# EAGLE schematic musical-plant (EAGLE 7.6.0)
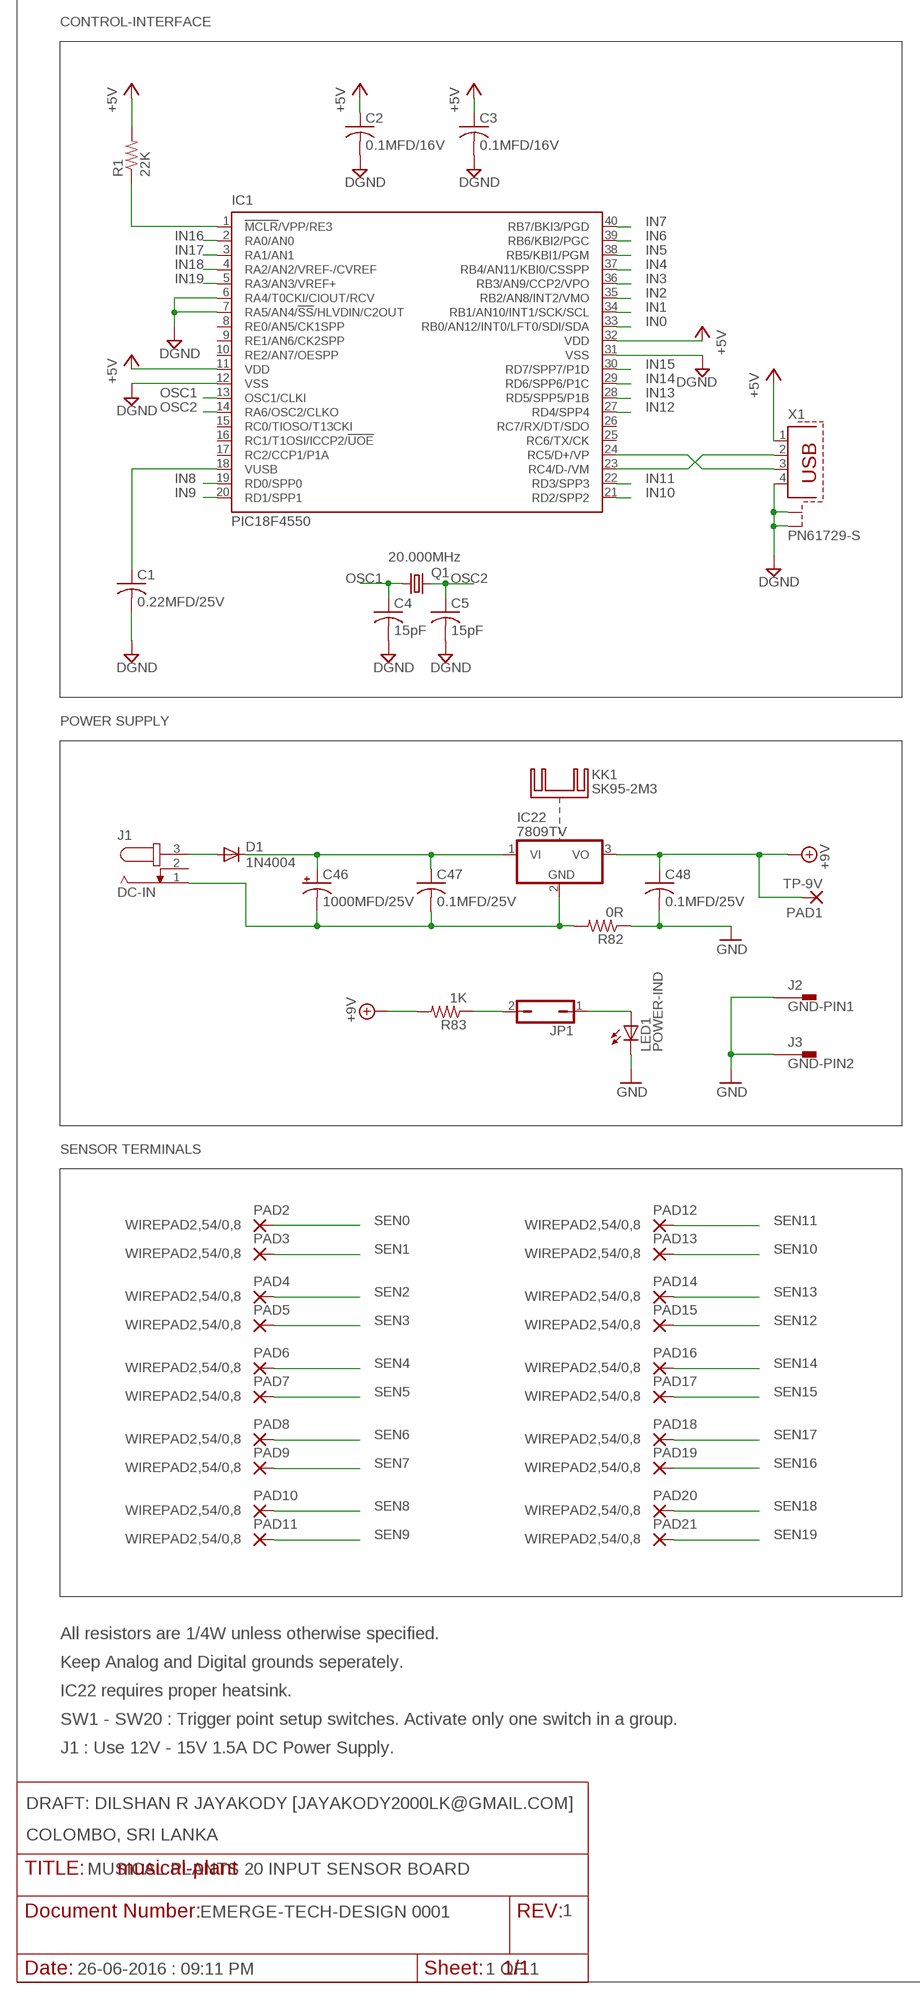
[diagram p0: schematic, sheet 1, part 1 of 2]
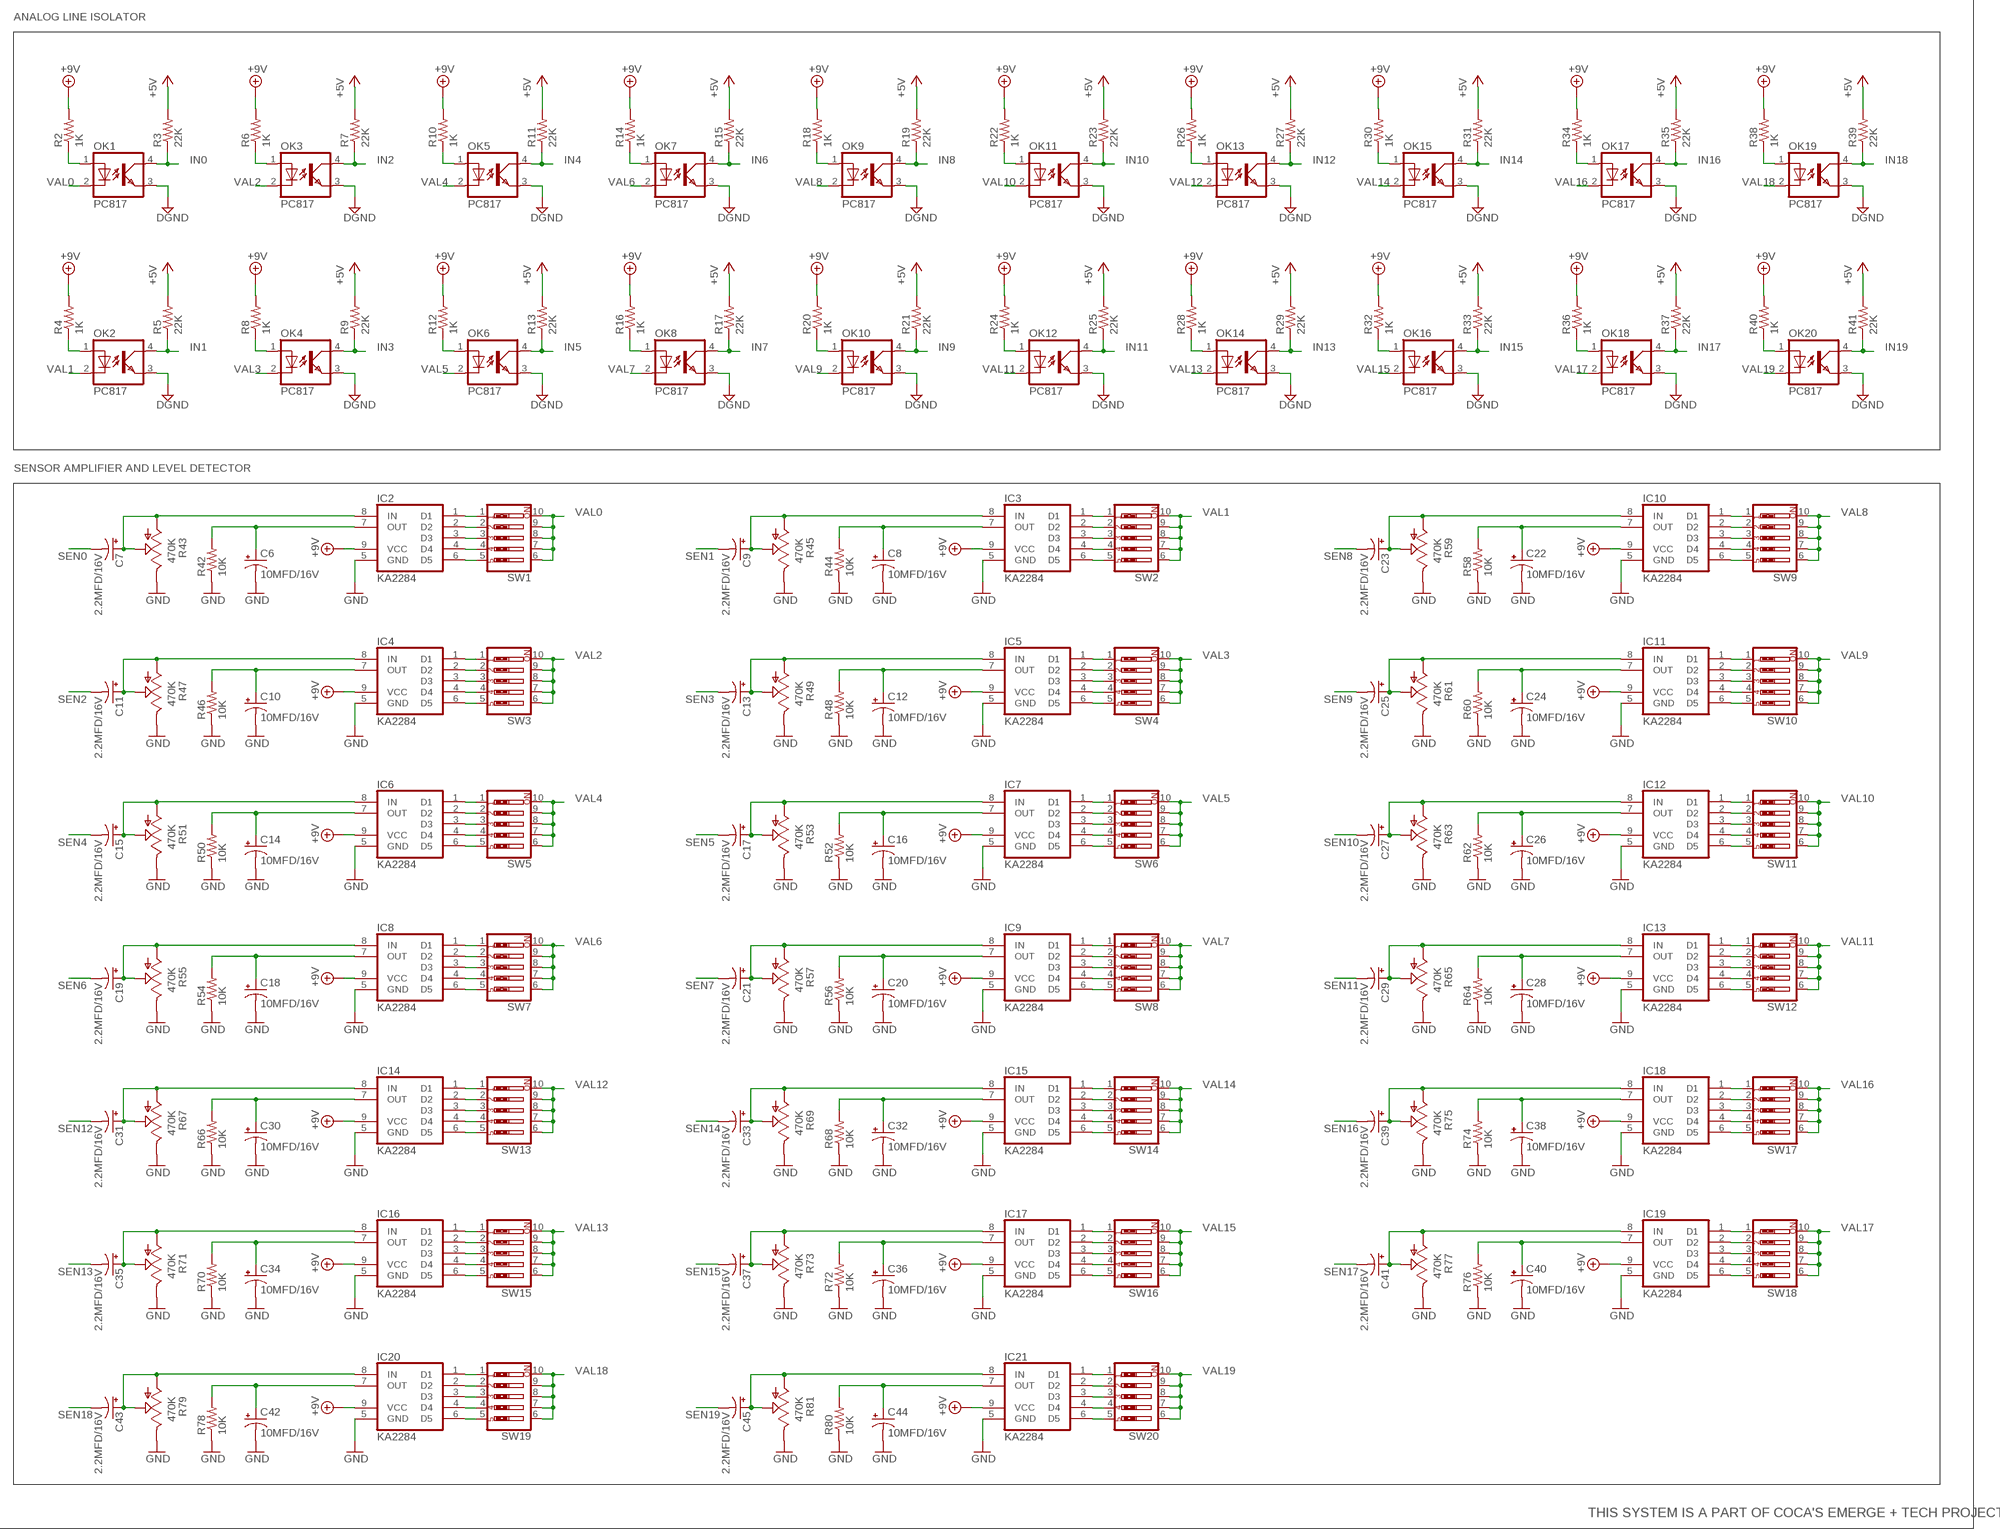
[diagram p1: schematic, sheet 1, part 2 of 2]

## Parts
C1  0.22MFD/25V  C-US075-052X106  [C075-052X106]
C2  0.1MFD/16V  C-US050-030X075  [C050-030X075]
C3  0.1MFD/16V  C-US050-030X075  [C050-030X075]
C4  15pF  C-US025-025X050  [C025-025X050]
C5  15pF  C-US025-025X050  [C025-025X050]
C6  10MFD/16V  CPOL-USE2,5-6E  [E2,5-6E]
C7  2.2MFD/16V  CPOL-USE2,5-6E  [E2,5-6E]
C8  10MFD/16V  CPOL-USE2,5-6E  [E2,5-6E]
C9  2.2MFD/16V  CPOL-USE2,5-6E  [E2,5-6E]
C10  10MFD/16V  CPOL-USE2,5-6E  [E2,5-6E]
C11  2.2MFD/16V  CPOL-USE2,5-6E  [E2,5-6E]
C12  10MFD/16V  CPOL-USE2,5-6E  [E2,5-6E]
C13  2.2MFD/16V  CPOL-USE2,5-6E  [E2,5-6E]
C14  10MFD/16V  CPOL-USE2,5-6E  [E2,5-6E]
C15  2.2MFD/16V  CPOL-USE2,5-6E  [E2,5-6E]
C16  10MFD/16V  CPOL-USE2,5-6E  [E2,5-6E]
C17  2.2MFD/16V  CPOL-USE2,5-6E  [E2,5-6E]
C18  10MFD/16V  CPOL-USE2,5-6E  [E2,5-6E]
C19  2.2MFD/16V  CPOL-USE2,5-6E  [E2,5-6E]
C20  10MFD/16V  CPOL-USE2,5-6E  [E2,5-6E]
C21  2.2MFD/16V  CPOL-USE2,5-6E  [E2,5-6E]
C22  10MFD/16V  CPOL-USE2,5-6E  [E2,5-6E]
C23  2.2MFD/16V  CPOL-USE2,5-6E  [E2,5-6E]
C24  10MFD/16V  CPOL-USE2,5-6E  [E2,5-6E]
C25  2.2MFD/16V  CPOL-USE2,5-6E  [E2,5-6E]
C26  10MFD/16V  CPOL-USE2,5-6E  [E2,5-6E]
C27  2.2MFD/16V  CPOL-USE2,5-6E  [E2,5-6E]
C28  10MFD/16V  CPOL-USE2,5-6E  [E2,5-6E]
C29  2.2MFD/16V  CPOL-USE2,5-6E  [E2,5-6E]
C30  10MFD/16V  CPOL-USE2,5-6E  [E2,5-6E]
C31  2.2MFD/16V  CPOL-USE2,5-6E  [E2,5-6E]
C32  10MFD/16V  CPOL-USE2,5-6E  [E2,5-6E]
C33  2.2MFD/16V  CPOL-USE2,5-6E  [E2,5-6E]
C34  10MFD/16V  CPOL-USE2,5-6E  [E2,5-6E]
C35  2.2MFD/16V  CPOL-USE2,5-6E  [E2,5-6E]
C36  10MFD/16V  CPOL-USE2,5-6E  [E2,5-6E]
C37  2.2MFD/16V  CPOL-USE2,5-6E  [E2,5-6E]
C38  10MFD/16V  CPOL-USE2,5-6E  [E2,5-6E]
C39  2.2MFD/16V  CPOL-USE2,5-6E  [E2,5-6E]
C40  10MFD/16V  CPOL-USE2,5-6E  [E2,5-6E]
C41  2.2MFD/16V  CPOL-USE2,5-6E  [E2,5-6E]
C42  10MFD/16V  CPOL-USE2,5-6E  [E2,5-6E]
C43  2.2MFD/16V  CPOL-USE2,5-6E  [E2,5-6E]
C44  10MFD/16V  CPOL-USE2,5-6E  [E2,5-6E]
C45  2.2MFD/16V  CPOL-USE2,5-6E  [E2,5-6E]
C46  1000MFD/25V  CPOL-USE5-13  [E5-13]
C47  0.1MFD/25V  C-US075-052X106  [C075-052X106]
C48  0.1MFD/25V  C-US075-052X106  [C075-052X106]
D1  1N4004  [DO41-10]
IC1  PIC18F4550  PIC18F4550_40  [DIL40]
IC2  KA2284  [SIP-9]
IC3  KA2284  [SIP-9]
IC4  KA2284  [SIP-9]
IC5  KA2284  [SIP-9]
IC6  KA2284  [SIP-9]
IC7  KA2284  [SIP-9]
IC8  KA2284  [SIP-9]
IC9  KA2284  [SIP-9]
IC10  KA2284  [SIP-9]
IC11  KA2284  [SIP-9]
IC12  KA2284  [SIP-9]
IC13  KA2284  [SIP-9]
IC14  KA2284  [SIP-9]
IC15  KA2284  [SIP-9]
IC16  KA2284  [SIP-9]
IC17  KA2284  [SIP-9]
IC18  KA2284  [SIP-9]
IC19  KA2284  [SIP-9]
IC20  KA2284  [SIP-9]
IC21  KA2284  [SIP-9]
IC22  7809TV  7812TV  [TO220V]
J1  DC-IN  JACK-PLUG1  [SPC4078]
J2  GND-PIN1  PIN2F061.080  [F061.080]
J3  GND-PIN2  PIN2F061.080  [F061.080]
JP1  JP1Q  [JP1]
KK1  SK95-2M3  [SK95-2M3]
LED1  POWER-IND  LED3MM  [LED3MM]
OK1  PC817  [DIL04]
OK2  PC817  [DIL04]
OK3  PC817  [DIL04]
OK4  PC817  [DIL04]
OK5  PC817  [DIL04]
OK6  PC817  [DIL04]
OK7  PC817  [DIL04]
OK8  PC817  [DIL04]
OK9  PC817  [DIL04]
OK10  PC817  [DIL04]
OK11  PC817  [DIL04]
OK12  PC817  [DIL04]
OK13  PC817  [DIL04]
OK14  PC817  [DIL04]
OK15  PC817  [DIL04]
OK16  PC817  [DIL04]
OK17  PC817  [DIL04]
OK18  PC817  [DIL04]
OK19  PC817  [DIL04]
OK20  PC817  [DIL04]
PAD1  TP-9V  WIREPAD2,15/1,0  [2,15/1,0]
PAD2  WIREPAD2,54/0,8  [2,54/0,8]
PAD3  WIREPAD2,54/0,8  [2,54/0,8]
PAD4  WIREPAD2,54/0,8  [2,54/0,8]
PAD5  WIREPAD2,54/0,8  [2,54/0,8]
PAD6  WIREPAD2,54/0,8  [2,54/0,8]
PAD7  WIREPAD2,54/0,8  [2,54/0,8]
PAD8  WIREPAD2,54/0,8  [2,54/0,8]
PAD9  WIREPAD2,54/0,8  [2,54/0,8]
PAD10  WIREPAD2,54/0,8  [2,54/0,8]
PAD11  WIREPAD2,54/0,8  [2,54/0,8]
PAD12  WIREPAD2,54/0,8  [2,54/0,8]
PAD13  WIREPAD2,54/0,8  [2,54/0,8]
PAD14  WIREPAD2,54/0,8  [2,54/0,8]
PAD15  WIREPAD2,54/0,8  [2,54/0,8]
PAD16  WIREPAD2,54/0,8  [2,54/0,8]
PAD17  WIREPAD2,54/0,8  [2,54/0,8]
PAD18  WIREPAD2,54/0,8  [2,54/0,8]
PAD19  WIREPAD2,54/0,8  [2,54/0,8]
PAD20  WIREPAD2,54/0,8  [2,54/0,8]
PAD21  WIREPAD2,54/0,8  [2,54/0,8]
Q1  20.000MHz  CRYSTALHC49S  [HC49/S]
R1  22K  R-US_0207/10  [0207/10]
R2  1K  R-US_0207/10  [0207/10]
R3  22K  R-US_0207/15  [0207/15]
R4  1K  R-US_0207/10  [0207/10]
R5  22K  R-US_0207/15  [0207/15]
R6  1K  R-US_0207/10  [0207/10]
R7  22K  R-US_0207/15  [0207/15]
R8  1K  R-US_0207/10  [0207/10]
R9  22K  R-US_0207/15  [0207/15]
R10  1K  R-US_0207/10  [0207/10]
R11  22K  R-US_0207/15  [0207/15]
R12  1K  R-US_0207/10  [0207/10]
R13  22K  R-US_0207/15  [0207/15]
R14  1K  R-US_0207/10  [0207/10]
R15  22K  R-US_0207/15  [0207/15]
R16  1K  R-US_0207/10  [0207/10]
R17  22K  R-US_0207/15  [0207/15]
R18  1K  R-US_0207/10  [0207/10]
R19  22K  R-US_0207/15  [0207/15]
R20  1K  R-US_0207/10  [0207/10]
R21  22K  R-US_0207/15  [0207/15]
R22  1K  R-US_0207/10  [0207/10]
R23  22K  R-US_0207/15  [0207/15]
R24  1K  R-US_0207/10  [0207/10]
R25  22K  R-US_0207/15  [0207/15]
R26  1K  R-US_0207/10  [0207/10]
R27  22K  R-US_0207/15  [0207/15]
R28  1K  R-US_0207/10  [0207/10]
R29  22K  R-US_0207/15  [0207/15]
R30  1K  R-US_0207/10  [0207/10]
R31  22K  R-US_0207/15  [0207/15]
R32  1K  R-US_0207/10  [0207/10]
R33  22K  R-US_0207/15  [0207/15]
R34  1K  R-US_0207/10  [0207/10]
R35  22K  R-US_0207/15  [0207/15]
R36  1K  R-US_0207/10  [0207/10]
R37  22K  R-US_0207/15  [0207/15]
R38  1K  R-US_0207/10  [0207/10]
R39  22K  R-US_0207/15  [0207/15]
R40  1K  R-US_0207/10  [0207/10]
R41  22K  R-US_0207/15  [0207/15]
R42  10K  R-US_0207/10  [0207/10]
R43  470K  TRIM_US-RS3  [RS3]
R44  10K  R-US_0207/10  [0207/10]
R45  470K  TRIM_US-RS3  [RS3]
R46  10K  R-US_0207/10  [0207/10]
R47  470K  TRIM_US-RS3  [RS3]
R48  10K  R-US_0207/10  [0207/10]
R49  470K  TRIM_US-RS3  [RS3]
R50  10K  R-US_0207/10  [0207/10]
R51  470K  TRIM_US-RS3  [RS3]
R52  10K  R-US_0207/10  [0207/10]
R53  470K  TRIM_US-RS3  [RS3]
R54  10K  R-US_0207/10  [0207/10]
R55  470K  TRIM_US-RS3  [RS3]
R56  10K  R-US_0207/10  [0207/10]
R57  470K  TRIM_US-RS3  [RS3]
R58  10K  R-US_0207/10  [0207/10]
R59  470K  TRIM_US-RS3  [RS3]
R60  10K  R-US_0207/10  [0207/10]
R61  470K  TRIM_US-RS3  [RS3]
R62  10K  R-US_0207/10  [0207/10]
R63  470K  TRIM_US-RS3  [RS3]
R64  10K  R-US_0207/10  [0207/10]
R65  470K  TRIM_US-RS3  [RS3]
R66  10K  R-US_0207/10  [0207/10]
R67  470K  TRIM_US-RS3  [RS3]
R68  10K  R-US_0207/10  [0207/10]
R69  470K  TRIM_US-RS3  [RS3]
R70  10K  R-US_0207/10  [0207/10]
R71  470K  TRIM_US-RS3  [RS3]
R72  10K  R-US_0207/10  [0207/10]
R73  470K  TRIM_US-RS3  [RS3]
R74  10K  R-US_0207/10  [0207/10]
R75  470K  TRIM_US-RS3  [RS3]
R76  10K  R-US_0207/10  [0207/10]
R77  470K  TRIM_US-RS3  [RS3]
R78  10K  R-US_0207/10  [0207/10]
R79  470K  TRIM_US-RS3  [RS3]
R80  10K  R-US_0207/10  [0207/10]
R81  470K  TRIM_US-RS3  [RS3]
R82  0R  R-US_0207/10  [0207/10]
R83  1K  R-US_0207/10  [0207/10]
SW1  SW_DIP-5  [EDG-05]
SW2  SW_DIP-5  [EDG-05]
SW3  SW_DIP-5  [EDG-05]
SW4  SW_DIP-5  [EDG-05]
SW5  SW_DIP-5  [EDG-05]
SW6  SW_DIP-5  [EDG-05]
SW7  SW_DIP-5  [EDG-05]
SW8  SW_DIP-5  [EDG-05]
SW9  SW_DIP-5  [EDG-05]
SW10  SW_DIP-5  [EDG-05]
SW11  SW_DIP-5  [EDG-05]
SW12  SW_DIP-5  [EDG-05]
SW13  SW_DIP-5  [EDG-05]
SW14  SW_DIP-5  [EDG-05]
SW15  SW_DIP-5  [EDG-05]
SW16  SW_DIP-5  [EDG-05]
SW17  SW_DIP-5  [EDG-05]
SW18  SW_DIP-5  [EDG-05]
SW19  SW_DIP-5  [EDG-05]
SW20  SW_DIP-5  [EDG-05]
X1  PN61729-S  [PN61729-S]

## Nets
+5V: C2.1 C3.1 IC1.11(VDD) IC1.32(VDD) R1.2 R3.2 R5.2 R7.2 R9.2 R11.2 R13.2 R15.2 R17.2 R19.2 R21.2 R23.2 R25.2 R27.2 R29.2 R31.2 R33.2 R35.2 R37.2 R39.2 R41.2 X1.1
+9V: C48.1 IC2.9(VCC) IC3.9(VCC) IC4.9(VCC) IC5.9(VCC) IC6.9(VCC) IC7.9(VCC) IC8.9(VCC) IC9.9(VCC) IC10.9(VCC) IC11.9(VCC) IC12.9(VCC) IC13.9(VCC) IC14.9(VCC) IC15.9(VCC) IC16.9(VCC) IC17.9(VCC) IC18.9(VCC) IC19.9(VCC) IC20.9(VCC) IC21.9(VCC) IC22.3(VO) PAD1.1(P) R2.2 R4.2 R6.2 R8.2 R10.2 R12.2 R14.2 R16.2 R18.2 R20.2 R22.2 R24.2 R26.2 R28.2 R30.2 R32.2 R34.2 R36.2 R38.2 R40.2 R83.2
D-MINUS: IC1.23(RC4/D-/VM) X1.2
D-PLUS: IC1.24(RC5/D+/VP) X1.3
DGND: C1.2 C2.2 C3.2 C4.2 C5.2 IC1.6(RA4/T0CKI/CIOUT/RCV) IC1.7(RA5/AN4/!SS!/HLVDIN/C2OUT) IC1.12(VSS) IC1.31(VSS) OK1.3(EMIT) OK2.3(EMIT) OK3.3(EMIT) OK4.3(EMIT) OK5.3(EMIT) OK6.3(EMIT) OK7.3(EMIT) OK8.3(EMIT) OK9.3(EMIT) OK10.3(EMIT) OK11.3(EMIT) OK12.3(EMIT) OK13.3(EMIT) OK14.3(EMIT) OK15.3(EMIT) OK16.3(EMIT) OK17.3(EMIT) OK18.3(EMIT) OK19.3(EMIT) OK20.3(EMIT) X1.4 X1.S1 X1.S2
GND: C6.- C8.- C10.- C12.- C14.- C16.- C18.- C20.- C22.- C24.- C26.- C28.- C30.- C32.- C34.- C36.- C38.- C40.- C42.- C44.- C48.2 IC2.5(GND) IC3.5(GND) IC4.5(GND) IC5.5(GND) IC6.5(GND) IC7.5(GND) IC8.5(GND) IC9.5(GND) IC10.5(GND) IC11.5(GND) IC12.5(GND) IC13.5(GND) IC14.5(GND) IC15.5(GND) IC16.5(GND) IC17.5(GND) IC18.5(GND) IC19.5(GND) IC20.5(GND) IC21.5(GND) J2.1A J2.1B J3.1A J3.1B LED1.K(C) R42.1 R43.E R44.1 R45.E R46.1 R47.E R48.1 R49.E R50.1 R51.E R52.1 R53.E R54.1 R55.E R56.1 R57.E R58.1 R59.E R60.1 R61.E R62.1 R63.E R64.1 R65.E R66.1 R67.E R68.1 R69.E R70.1 R71.E R72.1 R73.E R74.1 R75.E R76.1 R77.E R78.1 R79.E R80.1 R81.E R82.1
IN0: IC1.33(RB0/AN12/INT0/LFT0/SDI/SDA) OK1.4(COL) R3.1
IN1: IC1.34(RB1/AN10/INT1/SCK/SCL) OK2.4(COL) R5.1
IN2: IC1.35(RB2/AN8/INT2/VMO) OK3.4(COL) R7.1
IN3: IC1.36(RB3/AN9/CCP2/VPO) OK4.4(COL) R9.1
IN4: IC1.37(RB4/AN11/KBI0/CSSPP) OK5.4(COL) R11.1
IN5: IC1.38(RB5/KBI1/PGM) OK6.4(COL) R13.1
IN6: IC1.39(RB6/KBI2/PGC) OK7.4(COL) R15.1
IN7: IC1.40(RB7/BKI3/PGD) OK8.4(COL) R17.1
IN8: IC1.19(RD0/SPP0) OK9.4(COL) R19.1
IN9: IC1.20(RD1/SPP1) OK10.4(COL) R21.1
IN10: IC1.21(RD2/SPP2) OK11.4(COL) R23.1
IN11: IC1.22(RD3/SPP3) OK12.4(COL) R25.1
IN12: IC1.27(RD4/SPP4) OK13.4(COL) R27.1
IN13: IC1.28(RD5/SPP5/P1B) OK14.4(COL) R29.1
IN14: IC1.29(RD6/SPP6/P1C) OK15.4(COL) R31.1
IN15: IC1.30(RD7/SPP7/P1D) OK16.4(COL) R33.1
IN16: IC1.2(RA0/AN0) OK17.4(COL) R35.1
IN17: IC1.3(RA1/AN1) OK18.4(COL) R37.1
IN18: IC1.4(RA2/AN2/VREF-/CVREF) OK19.4(COL) R39.1
IN19: IC1.5(RA3/AN3/VREF+) OK20.4(COL) R41.1
MCLR: IC1.1(!MCLR!/VPP/RE3) R1.1
N$1: OK1.1(A) R2.1
N$2: OK2.1(A) R4.1
N$3: OK3.1(A) R6.1
N$4: OK4.1(A) R8.1
N$5: OK5.1(A) R10.1
N$6: OK6.1(A) R12.1
N$7: OK7.1(A) R14.1
N$8: OK8.1(A) R16.1
N$9: OK9.1(A) R18.1
N$10: OK10.1(A) R20.1
N$11: OK11.1(A) R22.1
N$12: OK12.1(A) R24.1
N$13: OK13.1(A) R26.1
N$14: OK14.1(A) R28.1
N$15: OK15.1(A) R30.1
N$16: OK16.1(A) R32.1
N$17: OK17.1(A) R34.1
N$18: OK18.1(A) R36.1
N$19: OK19.1(A) R38.1
N$20: OK20.1(A) R40.1
N$21: IC2.1(D1) SW1.1
N$22: IC2.2(D2) SW1.2
N$23: IC2.3(D3) SW1.3
N$24: IC2.4(D4) SW1.4
N$25: IC2.6(D5) SW1.5
N$26: C6.+ IC2.7(OUT) R42.2
N$27: C7.+ IC2.8(IN) R43.A R43.S
N$28: IC3.1(D1) SW2.1
N$29: IC3.2(D2) SW2.2
N$30: IC3.3(D3) SW2.3
N$31: IC3.4(D4) SW2.4
N$32: IC3.6(D5) SW2.5
N$33: C8.+ IC3.7(OUT) R44.2
N$34: C9.+ IC3.8(IN) R45.A R45.S
N$35: IC4.1(D1) SW3.1
N$36: IC4.2(D2) SW3.2
N$37: IC4.3(D3) SW3.3
N$38: IC4.4(D4) SW3.4
N$39: IC4.6(D5) SW3.5
N$40: C10.+ IC4.7(OUT) R46.2
N$41: C11.+ IC4.8(IN) R47.A R47.S
N$42: IC5.1(D1) SW4.1
N$43: IC5.2(D2) SW4.2
N$44: IC5.3(D3) SW4.3
N$45: IC5.4(D4) SW4.4
N$46: IC5.6(D5) SW4.5
N$47: C12.+ IC5.7(OUT) R48.2
N$48: C13.+ IC5.8(IN) R49.A R49.S
N$49: IC6.1(D1) SW5.1
N$50: IC6.2(D2) SW5.2
N$51: IC6.3(D3) SW5.3
N$52: IC6.4(D4) SW5.4
N$53: IC6.6(D5) SW5.5
N$54: C14.+ IC6.7(OUT) R50.2
N$55: C15.+ IC6.8(IN) R51.A R51.S
N$56: IC7.1(D1) SW6.1
N$57: IC7.2(D2) SW6.2
N$58: IC7.3(D3) SW6.3
N$59: IC7.4(D4) SW6.4
N$60: IC7.6(D5) SW6.5
N$61: C16.+ IC7.7(OUT) R52.2
N$62: C17.+ IC7.8(IN) R53.A R53.S
N$63: IC8.1(D1) SW7.1
N$64: IC8.2(D2) SW7.2
N$65: IC8.3(D3) SW7.3
N$66: IC8.4(D4) SW7.4
N$67: IC8.6(D5) SW7.5
N$68: C18.+ IC8.7(OUT) R54.2
N$69: C19.+ IC8.8(IN) R55.A R55.S
N$70: IC9.1(D1) SW8.1
N$71: IC9.2(D2) SW8.2
N$72: IC9.3(D3) SW8.3
N$73: IC9.4(D4) SW8.4
N$74: IC9.6(D5) SW8.5
N$75: C20.+ IC9.7(OUT) R56.2
N$76: C21.+ IC9.8(IN) R57.A R57.S
N$77: IC10.1(D1) SW9.1
N$78: IC10.2(D2) SW9.2
N$79: IC10.3(D3) SW9.3
N$80: IC10.4(D4) SW9.4
N$81: IC10.6(D5) SW9.5
N$82: C22.+ IC10.7(OUT) R58.2
N$83: C23.+ IC10.8(IN) R59.A R59.S
N$84: IC11.1(D1) SW10.1
N$85: IC11.2(D2) SW10.2
N$86: IC11.3(D3) SW10.3
N$87: IC11.4(D4) SW10.4
N$88: IC11.6(D5) SW10.5
N$89: C24.+ IC11.7(OUT) R60.2
N$90: C25.+ IC11.8(IN) R61.A R61.S
N$91: IC12.1(D1) SW11.1
N$92: IC12.2(D2) SW11.2
N$93: IC12.3(D3) SW11.3
N$94: IC12.4(D4) SW11.4
N$95: IC12.6(D5) SW11.5
N$96: C26.+ IC12.7(OUT) R62.2
N$97: C27.+ IC12.8(IN) R63.A R63.S
N$98: IC13.1(D1) SW12.1
N$99: IC13.2(D2) SW12.2
N$100: IC13.3(D3) SW12.3
N$101: IC13.4(D4) SW12.4
N$102: IC13.6(D5) SW12.5
N$103: C28.+ IC13.7(OUT) R64.2
N$104: C29.+ IC13.8(IN) R65.A R65.S
N$105: IC14.1(D1) SW13.1
N$106: IC14.2(D2) SW13.2
N$107: IC14.3(D3) SW13.3
N$108: IC14.4(D4) SW13.4
N$109: IC14.6(D5) SW13.5
N$110: C30.+ IC14.7(OUT) R66.2
N$111: C31.+ IC14.8(IN) R67.A R67.S
N$112: IC15.1(D1) SW14.1
N$113: IC15.2(D2) SW14.2
N$114: IC15.3(D3) SW14.3
N$115: IC15.4(D4) SW14.4
N$116: IC15.6(D5) SW14.5
N$117: C32.+ IC15.7(OUT) R68.2
N$118: C33.+ IC15.8(IN) R69.A R69.S
N$119: IC16.1(D1) SW15.1
N$120: IC16.2(D2) SW15.2
N$121: IC16.3(D3) SW15.3
N$122: IC16.4(D4) SW15.4
N$123: IC16.6(D5) SW15.5
N$124: C34.+ IC16.7(OUT) R70.2
N$125: C35.+ IC16.8(IN) R71.A R71.S
N$126: IC17.1(D1) SW16.1
N$127: IC17.2(D2) SW16.2
N$128: IC17.3(D3) SW16.3
N$129: IC17.4(D4) SW16.4
N$130: IC17.6(D5) SW16.5
N$131: C36.+ IC17.7(OUT) R72.2
N$132: C37.+ IC17.8(IN) R73.A R73.S
N$133: IC18.1(D1) SW17.1
N$134: IC18.2(D2) SW17.2
N$135: IC18.3(D3) SW17.3
N$136: IC18.4(D4) SW17.4
N$137: IC18.6(D5) SW17.5
N$138: C38.+ IC18.7(OUT) R74.2
N$139: C39.+ IC18.8(IN) R75.A R75.S
N$140: IC19.1(D1) SW18.1
N$141: IC19.2(D2) SW18.2
N$142: IC19.3(D3) SW18.3
N$143: IC19.4(D4) SW18.4
N$144: IC19.6(D5) SW18.5
N$145: C40.+ IC19.7(OUT) R76.2
N$146: C41.+ IC19.8(IN) R77.A R77.S
N$147: IC20.1(D1) SW19.1
N$148: IC20.2(D2) SW19.2
N$149: IC20.3(D3) SW19.3
N$150: IC20.4(D4) SW19.4
N$151: IC20.6(D5) SW19.5
N$152: C42.+ IC20.7(OUT) R78.2
N$153: C43.+ IC20.8(IN) R79.A R79.S
N$154: IC21.1(D1) SW20.1
N$155: IC21.2(D2) SW20.2
N$156: IC21.3(D3) SW20.3
N$157: IC21.4(D4) SW20.4
N$158: IC21.6(D5) SW20.5
N$159: C44.+ IC21.7(OUT) R80.2
N$160: C45.+ IC21.8(IN) R81.A R81.S
N$161: D1.A J1.3
N$162: C46.+ C47.1 D1.C IC22.1(VI)
N$163: C46.- C47.2 IC22.2(GND) J1.1 R82.2
N$164: JP1.1 LED1.A
N$165: JP1.2 R83.1
OSC1: C4.1 IC1.13(OSC1/CLKI) Q1.1
OSC2: C5.1 IC1.14(RA6/OSC2/CLKO) Q1.2
SEN0: C7.- PAD2.1(P)
SEN1: C9.- PAD3.1(P)
SEN2: C11.- PAD4.1(P)
SEN3: C13.- PAD5.1(P)
SEN4: C15.- PAD6.1(P)
SEN5: C17.- PAD7.1(P)
SEN6: C19.- PAD8.1(P)
SEN7: C21.- PAD9.1(P)
SEN8: C23.- PAD10.1(P)
SEN9: C25.- PAD11.1(P)
SEN10: C27.- PAD13.1(P)
SEN11: C29.- PAD12.1(P)
SEN12: C31.- PAD15.1(P)
SEN13: C35.- PAD14.1(P)
SEN14: C33.- PAD16.1(P)
SEN15: C37.- PAD17.1(P)
SEN16: C39.- PAD19.1(P)
SEN17: C41.- PAD18.1(P)
SEN18: C43.- PAD20.1(P)
SEN19: C45.- PAD21.1(P)
VAL0: OK1.2(C) SW1.6 SW1.7 SW1.8 SW1.9 SW1.10
VAL1: OK2.2(C) SW2.6 SW2.7 SW2.8 SW2.9 SW2.10
VAL2: OK3.2(C) SW3.6 SW3.7 SW3.8 SW3.9 SW3.10
VAL3: OK4.2(C) SW4.6 SW4.7 SW4.8 SW4.9 SW4.10
VAL4: OK5.2(C) SW5.6 SW5.7 SW5.8 SW5.9 SW5.10
VAL5: OK6.2(C) SW6.6 SW6.7 SW6.8 SW6.9 SW6.10
VAL6: OK7.2(C) SW7.6 SW7.7 SW7.8 SW7.9 SW7.10
VAL7: OK8.2(C) SW8.6 SW8.7 SW8.8 SW8.9 SW8.10
VAL8: OK9.2(C) SW9.6 SW9.7 SW9.8 SW9.9 SW9.10
VAL9: OK10.2(C) SW10.6 SW10.7 SW10.8 SW10.9 SW10.10
VAL10: OK11.2(C) SW11.6 SW11.7 SW11.8 SW11.9 SW11.10
VAL11: OK12.2(C) SW12.6 SW12.7 SW12.8 SW12.9 SW12.10
VAL12: OK13.2(C) SW13.6 SW13.7 SW13.8 SW13.9 SW13.10
VAL13: OK14.2(C) SW15.6 SW15.7 SW15.8 SW15.9 SW15.10
VAL14: OK15.2(C) SW14.6 SW14.7 SW14.8 SW14.9 SW14.10
VAL15: OK16.2(C) SW16.6 SW16.7 SW16.8 SW16.9 SW16.10
VAL16: OK17.2(C) SW17.6 SW17.7 SW17.8 SW17.9 SW17.10
VAL17: OK18.2(C) SW18.6 SW18.7 SW18.8 SW18.9 SW18.10
VAL18: OK19.2(C) SW19.6 SW19.7 SW19.8 SW19.9 SW19.10
VAL19: OK20.2(C) SW20.6 SW20.7 SW20.8 SW20.9 SW20.10
VUSB: C1.1 IC1.18(VUSB)
Unconnected: IC1.8(RE0/AN5/CK1SPP) IC1.9(RE1/AN6/CK2SPP) IC1.10(RE2/AN7/OESPP) IC1.15(RC0/TIOSO/T13CKI) IC1.16(RC1/T1OSI/ICCP2/!UOE) IC1.17(RC2/CCP1/P1A) IC1.25(RC6/TX/CK) IC1.26(RC7/RX/DT/SDO) J1.2

## Notes on the sheet
- CONTROL-INTERFACE | ANALOG LINE ISOLATOR
- SENSOR AMPLIFIER AND LEVEL DETECTOR
- POWER SUPPLY
- SENSOR TERMINALS
- All resistors are 1/4W unless otherwise specified.
- Keep Analog and Digital grounds seperately.
- IC22 requires proper heatsink.
- SW1 - SW20 : Trigger point setup switches. Activate only one switch in a group.
- J1 : Use 12V - 15V 1.5A DC Power Supply.
- DRAFT: DILSHAN R JAYAKODY [JAYAKODY2000LK@GMAIL.COM]
- COLOMBO, SRI LANKA
- MUSICAL PLANTS 20 INPUT SENSOR BOARD
- EMERGE-TECH-DESIGN 0001 | 1
- THIS SYSTEM IS A PART OF COCA'S EMERGE + TECH PROJECT.
- 26-06-2016 : 09:11 PM | 1 OF 1

## Library data of the parts
C1-C5 C47 C48 = rcl:C-US: CAPACITOR, American symbol
C6-C46 = rcl:CPOL-US: POLARIZED CAPACITOR, American symbol
D1 = diode:1N4004: DIODE general purpose rectifier, 1 A
IC1 = microchip:PIC18F4*_40: USB Microcontrollers with nanoWatt Technology High-Performance, Enhanced Flash, 28/40/44-Pin, Source: http://ww1.microchip.com/downloads/en/devicedoc/39632c.pdf; MF: MICROCHIP; MPN: PIC18F4550-I/P; OC_FARNELL: 9321357; OC_NEWARK: 74K8623
IC2-IC21 = musical-plant:KA2284: 5-Dot Dual Level Meter Driver
IC22 = linear:78*: Positive VOLTAGE REGULATOR Source: http://cache.national.com/ds/LM/LM78L05.pdf http://www.fairchildsemi.com/ds/LM/LM7805.pdf
J1 = con-jack:JACK-PLUG: DC POWER JACK Power Jack, DC, Right Angle, Through Hole, Rated 5A at 16VDC, PC Terminals Distributor: Farnell (www.Farnell.de) Drawing: 84N1161.pdf / 84N1162.pdf Manufacturer: SPC Technology (www.spctechnology.com) Type: SPC4077 / SPC 4078; OC_FARNELL: unknown; OC_NEWARK: unknown
J2 J3 = con-faston:PIN2: Flachstecker Typ Tyco/Electronics/AMP TAB, FASTON Printed Circuit Board Tabs Source: http://www.buerklin.com, http://catalog.tycoelectronics.com; OC_FARNELL: unknown; OC_NEWARK: unknown
JP1 = jumper:JP1Q: JUMPER
KK1 = heatsink:SK95-2M3: HEATSINK manufacturer Fischer/distributor Buerklin
LED1 = led:LED: LED OSRAM: - CHIPLED LG R971, LG N971, LY N971, LG Q971, LY Q971, LO R971, LY R971 LH N974, LH R974 LS Q976, LO Q976, LY Q976 LO Q996 - Hyper CHIPLED LW Q18S LB Q993, LB Q99A, LB R99A - SideLED LS A670, LO A670, LY A670, LG A670, LP A670 LB A673, LV A673, LT A673, LW A673 LH A674 LY A675 LS A676, LA A676, LO A676, LY A676, LW A676 LS A679, LY A679, LG A679 - Hyper Micro SIDELED® LS Y876, LA Y876, LO Y876, LY Y876 LT Y87S - SmartLED LW L88C, LW L88S LB L89C, LB L89S, LG L890 LS L89K, LO L89K, LY L89K LS L896, LA L896, LO L896, LY L896 - TOPLED LS T670, LO T670, LY T670, LG T670, LP T670 LSG T670, LSP T670, LSY T670, LOP T670, LYG T670 LG T671, LOG T671, LSG T671 LB T673, LV T673, LT T673, LW T673 LH T674 LS T676, LA T676, LO T676, LY T676, LB T676, LH T676, LSB T676, LW T676 LB T67C, LV T67C, LT T67C, LS T67K, LO T67K, LY T67K, LW E67C LS E67B, LA E67B, LO E67B, LY E67B, LB E67C, LV E67C, LT E67C LW T67C LS T679, LY T679, LG T679 LS T770, LO T770, LY T770, LG T770, LP T770 LB T773, LV T773, LT T773, LW T773 LH T774 LS E675, LA E675, LY E675, LS T675 LS T776, LA T776, LO T776, LY T776, LB T776 LHGB T686 LT T68C, LB T68C - Hyper Mini TOPLED® LB M676 - Mini TOPLED Santana® LG M470 LS M47K, LO M47K, LY M47K Source: http://www.osram.convergy.de LUXEON: - LUMILED® LXK2-PW12-R00, LXK2-PW12-S00, LXK2-PW14-U00, LXK2-PW14-V00 LXK2-PM12-R00, LXK2-PM12-S00, LXK2-PM14-U00 LXK2-PE12-Q00, LXK2-PE12-R00, LXK2-PE12-S00, LXK2-PE14-T00, LXK2-PE14-U00 LXK2-PB12-K00, LXK2-PB12-L00, LXK2-PB12-M00, LXK2-PB14-N00, LXK2-PB14-P00, LXK2-PB14-Q00 LXK2-PR12-L00, LXK2-PR12-M00, LXK2-PR14-Q00, LXK2-PR14-R00 LXK2-PD12-Q00, LXK2-PD12-R00, LXK2-PD12-S00 LXK2-PH12-R00, LXK2-PH12-S00 LXK2-PL12-P00, LXK2-PL12-Q00, LXK2-PL12-R00 Source: www.luxeon.com KINGBRIGHT: KA-3528ASYC Source: www.kingbright.com
OK1-OK20 = optocoupler:PC817: SHARP OPTO COUPLER; MPN: PC817X4J000F; OC_FARNELL: 9707727; OC_NEWARK: 97K7059
PAD1-PAD21 = wirepad:WIREPAD: Wire PAD connect wire on PCB
Q1 = crystal:CRYSTAL: CRYSTAL; OC_FARNELL: 1667008; OC_NEWARK: unknown
R1-R42 R44 R46 R48 R50 R52 R54 R56 R58 R60 R62 R64 R66 R68 R70 R72 R74 R76 R78 R80 R82 R83 = resistor:R-US_: RESISTOR, American symbol
R43 R45 R47 R49 R51 R53 R55 R57 R59 R61 R63 R65 R67 R69 R71 R73 R75 R77 R79 R81 = pot:TRIM_US-: POTENTIOMETER
SW1-SW20 = special:SW_DIP-5: DIP SWITCH
X1 = con-berg:PN61729-S: BERG USB connector; OC_FARNELL: unknown; OC_NEWARK: unknown